# EAGLE design track_voltage_v1.2 (EAGLE 9.2.1)
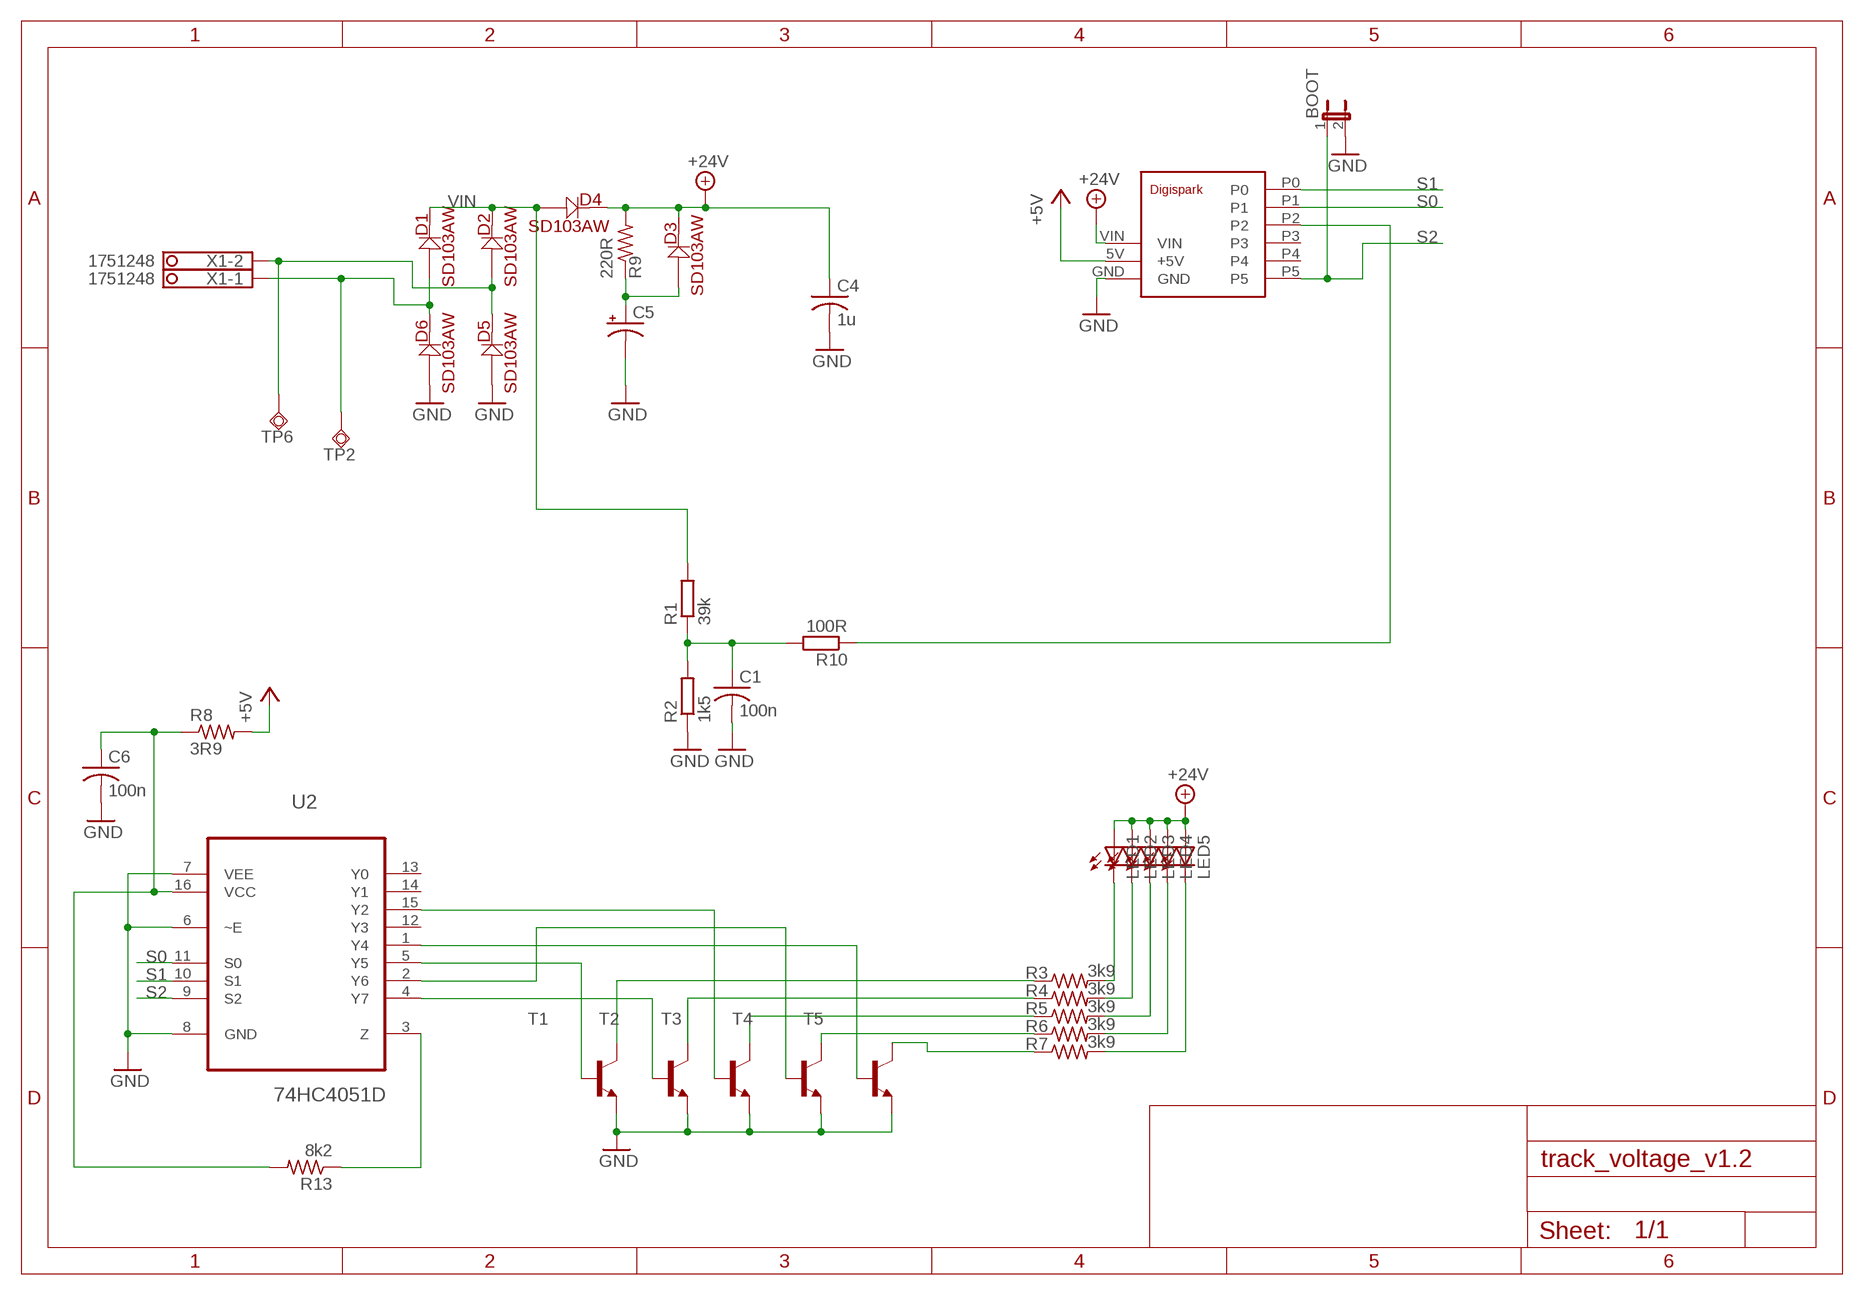
[diagram p0: schematic, sheet 1]

## Parts
BOOT  JP1E  [JP1]
C1  100n  C-USC0603  [C0603]
C4  1u  C-USC0603  [C0603]
C5  CPOL-USE3.5-10  [E3,5-10]
C6  100n  C-USC0603  [C0603]
D1  SD103AW  [SOD-123]
D2  SD103AW  [SOD-123]
D3  SD103AW  [SOD-123]
D4  SD103AW  [SOD-123]
D5  SD103AW  [SOD-123]
D6  SD103AW  [SOD-123]
LED1  LED3MM  [LED3MM]
LED2  LED3MM  [LED3MM]
LED3  LED3MM  [LED3MM]
LED4  LED3MM  [LED3MM]
LED5  LED3MM  [LED3MM]
R1  39k  R-EU_R0603  [R0603]
R2  1k5  R-EU_R0603  [R0603]
R3  3k9  R-US_R0805  [R0805]
R4  3k9  R-US_R0805  [R0805]
R5  3k9  R-US_R0805  [R0805]
R6  3k9  R-US_R0805  [R0805]
R7  3k9  R-US_R0805  [R0805]
R8  3R9  R-US_R1206  [R1206]
R9  220R  R-US_R0805  [R0805]
R10  100R  R-EU_R0603  [R0603]
R13  8k2  R-US_R0603  [R0603]
T1  BC817-16-NPN-SOT23-BEC  [SOT23-BEC]
T2  BC817-16-NPN-SOT23-BEC  [SOT23-BEC]
T3  BC817-16-NPN-SOT23-BEC  [SOT23-BEC]
T4  BC817-16-NPN-SOT23-BEC  [SOT23-BEC]
T5  BC817-16-NPN-SOT23-BEC  [SOT23-BEC]
TP2  TPSQTP20SQ  [TP20SQ]
TP6  TPSQTP20SQ  [TP20SQ]
U2  74HC4051D  [SOIC127P600X175-16N]
U$2  DIGISPARK  [DIGISPARK_78M05]
X1  1751248  [1751248]

## Nets
+5V: R8.2 U$2.5V(+5V)
+24V: C4.1 D3.- D4.- LED1.A LED2.A LED3.A LED4.A LED5.A R9.2 U$2.VIN
GND: BOOT.2 C1.2 C4.2 C5.- C6.2 D5.+ D6.+ R2.1 T1.E T2.E T3.E T4.E T5.E U2.6(~E) U2.7(VEE) U2.8(GND) U$2.GND
N$2: R10.1 U$2.P2
N$3: C6.1 R8.1 R13.2 U2.16(VCC)
N$4: T2.B U2.4(Y7)
N$6: T1.B U2.5(Y5)
N$8: LED1.K(C) R3.2
N$9: C5.+ D3.+ R9.1
N$11: R3.1 T1.C
N$12: R4.1 T2.C
N$13: R5.1 T3.C
N$14: R6.1 T4.C
N$15: R7.1 T5.C
N$16: LED2.K(C) R4.2
N$17: LED3.K(C) R5.2
N$18: LED4.K(C) R6.2
N$19: LED5.K(C) R7.2
N$21: D2.+ D5.- TP6.TP X1.2
N$22: C1.1 R1.1 R2.2 R10.2
N$25: T3.B U2.15(Y2)
N$26: D1.+ D6.- TP2.TP X1.1
N$27: T4.B U2.2(Y6)
N$28: T5.B U2.1(Y4)
N$29: R13.1 U2.3(Z)
S0: U2.11(S0) U$2.P1
S1: U2.10(S1) U$2.P0
S2: BOOT.1 U2.9(S2) U$2.P5
VIN: D1.- D2.- D4.+ R1.2
Unconnected: U2.12(Y3) U2.13(Y0) U2.14(Y1) U$2.P3 U$2.P4

## Library data of the parts
BOOT = jumper:JP1E: JUMPER
C1 C4 C6 = rcl:C-US: CAPACITOR, American symbol; SPICEPREFIX: C
C5 = rcl:CPOL-US: POLARIZED CAPACITOR, American symbol; SPICEPREFIX: C
D1-D6 = SD103AW:SD103AW
LED1-LED5 = led:LED: LED OSRAM: - CHIPLED LG R971, LG N971, LY N971, LG Q971, LY Q971, LO R971, LY R971 LH N974, LH R974 LS Q976, LO Q976, LY Q976 LO Q996 - Hyper CHIPLED LW Q18S LB Q993, LB Q99A, LB R99A - SideLED LS A670, LO A670, LY A670, LG A670, LP A670 LB A673, LV A673, LT A673, LW A673 LH A674 LY A675 LS A676, LA A676, LO A676, LY A676, LW A676 LS A679, LY A679, LG A679 - Hyper Micro SIDELED® LS Y876, LA Y876, LO Y876, LY Y876 LT Y87S - SmartLED LW L88C, LW L88S LB L89C, LB L89S, LG L890 LS L89K, LO L89K, LY L89K LS L896, LA L896, LO L896, LY L896 - TOPLED LS T670, LO T670, LY T670, LG T670, LP T670 LSG T670, LSP T670, LSY T670, LOP T670, LYG T670 LG T671, LOG T671, LSG T671 LB T673, LV T673, LT T673, LW T673 LH T674 LS T676, LA T676, LO T676, LY T676, LB T676, LH T676, LSB T676, LW T676 LB T67C, LV T67C, LT T67C, LS T67K, LO T67K, LY T67K, LW E67C LS E67B, LA E67B, LO E67B, LY E67B, LB E67C, LV E67C, LT E67C LW T67C LS T679, LY T679, LG T679 LS T770, LO T770, LY T770, LG T770, LP T770 LB T773, LV T773, LT T773, LW T773 LH T774 LS E675, LA E675, LY E675, LS T675 LS T776, LA T776, LO T776, LY T776, LB T776 LHGB T686 LT T68C, LB T68C - Hyper Mini TOPLED® LB M676 - Mini TOPLED Santana® LG M470 LS M47K, LO M47K, LY M47K Source: http://www.osram.convergy.de LUXEON: - LUMILED® LXK2-PW12-R00, LXK2-PW12-S00, LXK2-PW14-U00, LXK2-PW14-V00 LXK2-PM12-R00, LXK2-PM12-S00, LXK2-PM14-U00 LXK2-PE12-Q00, LXK2-PE12-R00, LXK2-PE12-S00, LXK2-PE14-T00, LXK2-PE14-U00 LXK2-PB12-K00, LXK2-PB12-L00, LXK2-PB12-M00, LXK2-PB14-N00, LXK2-PB14-P00, LXK2-PB14-Q00 LXK2-PR12-L00, LXK2-PR12-M00, LXK2-PR14-Q00, LXK2-PR14-R00 LXK2-PD12-Q00, LXK2-PD12-R00, LXK2-PD12-S00 LXK2-PH12-R00, LXK2-PH12-S00 LXK2-PL12-P00, LXK2-PL12-Q00, LXK2-PL12-R00 Source: www.luxeon.com KINGBRIGHT: KA-3528ASYC Source: www.kingbright.com
R1 R2 R10 = rcl:R-EU_: RESISTOR, European symbol; SPICEPREFIX: R
R3-R9 R13 = rcl:R-US_: RESISTOR, American symbol; SPICEPREFIX: R
T1-T5 = transistor:*-NPN-: NPN Transistror BF959 corrected 2008.03.06
TP2 TP6 = testpad:TPSQ: Test pad
U2 = 74HC4051D:74HC4051D: 8-channel analog multiplexer/demultiplexer; AVAILABILITY: Unavailable; DESCRIPTION: Single 8-Channel Analog Multiplexer/Demultiplexer, VCC=2 to 6V, PD=500mW, tpd/tpz=15ns_typ._; MF: Toshiba Semiconductor; MP: 74HC4051D; PACKAGE: SOIC-16 Toshiba; PRICE: None
U$2 = digispark:DIGISPARK
X1 = con-phoenix-350:1751248: MKDS 1/ 2-3,5 Printklemme Nennstrom: 10 A Bemessungsspannung: 160 V Raster: 3,5 mm Polzahl: 2 Montageart: Löten Anschlussart: Schraubanschluss Anschlussrichtung vom Leiter zur Platine: 0° Source: http://eshop.phoenixcontact.com .. 1751248.pdf; OC_FARNELL: unknown; OC_NEWARK: unknown

## Board
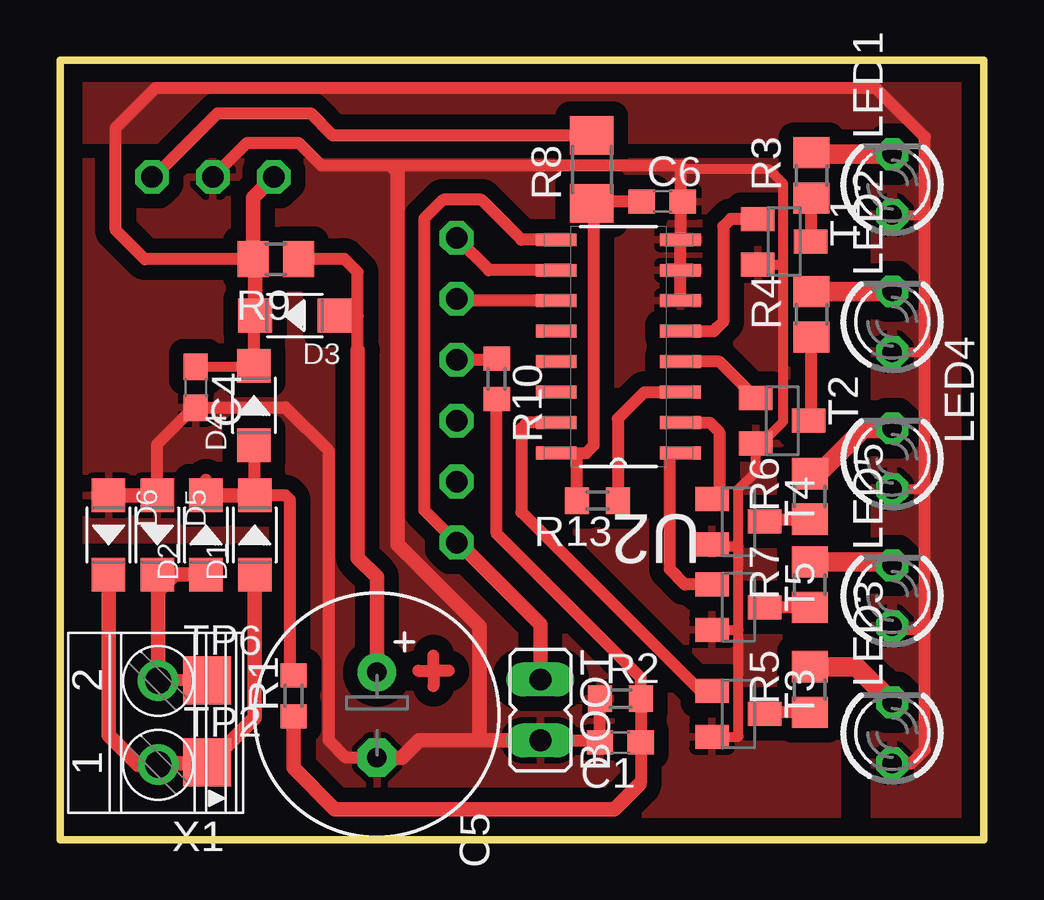
[diagram p1: board, top side]
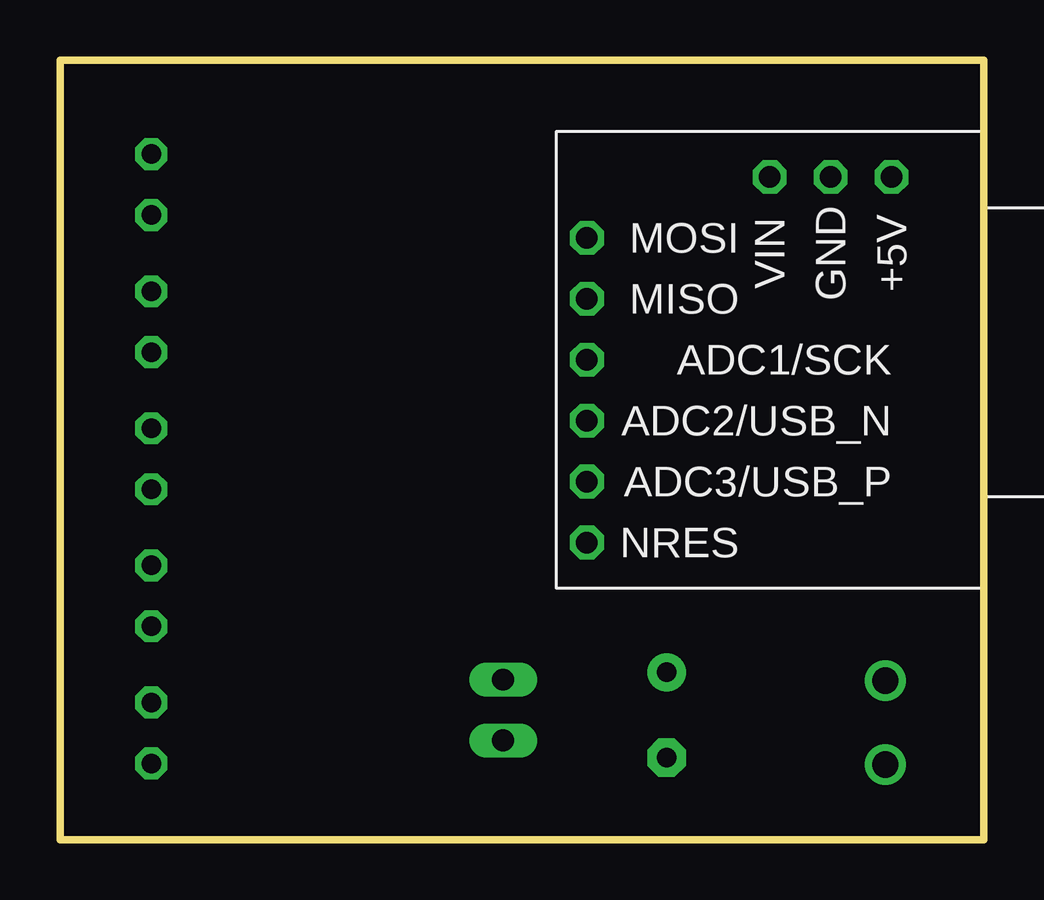
[diagram p2: board, bottom side, seen from below]

Size 38.5 x 32.5 mm. Coordinates in mm from the lower left corner, seen from the top.
Outline: 0,0 38.5,0 38.5,32.5 0,32.5 0,0
Copper layers (1*16): Top 0.035mm / dielectric 1.5mm / Bottom 0.035mm
Design rules "default *": minimum track width 6mil, minimum drill 0.35mm, track to track 6mil, track to pad 6mil, pad to pad 6mil, via to via 6mil, smd to smd 6mil, copper to edge 30mil, drill to drill 6mil, minimum pad ring 10mil, minimum via ring 8mil, stop-mask expansion 4mil, vias tented up to drill 0mil, thermal gap 10mil

### Footprints (pad centres in the part's own frame; a part is rotated, then mirrored left to right if it is on the bottom)
JP1 = drill 0.914 long: 1 0,-1.27; 2 0,1.27
C0603 = smd 1.1 x 1: 1 -0.85,0; 2 0.85,0
E3,5-10 = drill 0.813 pad 1.6: + -1.778,0 | drill 0.813 pad 1.6 octagon: - 1.778,0
SOD-123 = smd 1.397 x 1.397: + -1.651,0; - 1.651,0
LED3MM = drill 0.813 octagon: A -1.27,0; K 1.27,0
R0603 = smd 1 x 1.1: 1 -0.85,0; 2 0.85,0
R0805 = smd 1.3 x 1.5: 1 -0.95,0; 2 0.95,0
R1206 = smd 1.6 x 1.803: 1 -1.422,0; 2 1.422,0
SOT23-BEC = smd 1 x 1.4: B -0.95,-1.1; C 0,1.1; E 0.95,-1.1
TP20SQ = smd 2 x 2: TP 0,0
SOIC127P600X175-16N = smd 1.702 x 0.533: 1 -2.591,4.445; 2 -2.591,3.175; 3 -2.591,1.905; 4 -2.591,0.635; 5 -2.591,-0.635; 6 -2.591,-1.905; 7 -2.591,-3.175; 8 -2.591,-4.445; 9 2.591,-4.445; 10 2.591,-3.175; 11 2.591,-1.905; 12 2.591,-0.635; 13 2.591,0.635; 14 2.591,1.905; 15 2.591,3.175; 16 2.591,4.445
DIGISPARK_78M05 = drill 0.9 octagon: 5V 2.54,0; GND 5.08,0; P0 15.24,2.54; P1 15.24,5.08; P2 15.24,7.62; P3 15.24,10.16; P4 15.24,12.7; P5 15.24,15.24; VIN 7.62,0
1751248 = drill 1.1 pad 1.7: 1 -1.75,-0.1; 2 1.75,-0.1

### Placement (x,y rotation side)
BOOT  20.03,5.4 180 top
C1  23.36,4.05 180 top
C4  5.67,18.85 270 top
C5  13.22,5.19 270 top
C6  25.11,26.59 0 top
D1  8.12,12.7 90 top
D2  6.09,12.7 90 top
D3  9.79,21.84 180 top
D4  8.09,18.1 90 top
D5  4.06,12.7 270 top
D6  2.02,12.7 270 top
LED1  34.69,27.3 90 top
LED2  34.69,21.59 90 top
LED3  34.69,4.45 90 top
LED4  34.69,15.88 90 top
LED5  34.69,10.16 90 top
R1  9.74,5.99 90 top
R2  23.36,5.87 0 top
R3  31.33,27.69 90 top
R4  31.33,21.89 90 top
R5  31.25,6.25 90 top
R6  31.25,14.3 90 top
R7  31.25,10.62 90 top
R8  22.17,27.94 90 top
R9  9,24.19 180 top
R10  18.2,19.21 270 top
R13  22.41,14.13 180 top
T1  30.19,24.92 270 top
T2  30.11,17.46 270 top
T3  28.28,5.24 270 top
T4  28.28,13.26 270 top
T5  28.28,9.68 270 top
TP2  6.14,3.22 0 top
TP6  6.14,6.64 0 top
U2  23.28,20.56 180 top
U$2  1.29,27.62 180 bottom
X1  3.99,4.87 90 top

### Tracks (layer width: path | path; a pad name or v marks a point on that pad's centre or on a via)
+5V
  Top 0.508: U$2.5V 3.91,27.62 6.57,30.28 10.46,30.28 11.37,29.36 R8.2
+24V
  Top 0.406: D4.- 8.04,19.7 C4.1 | LED1.A 36.06,26.04 | LED2.A 36.06,20.32 | LED4.A 36.06,14.61 | LED5.A 34.85,8.73 36.06,8.73
  Top 0.508: LED3.A 35.49,3.17 36.06,3.75 36.06,8.73 36.06,14.61 36.06,20.32 36.06,26.04 36.06,29.29 34.02,31.33 3.97,31.33 2.33,29.69 2.33,25.4 3.53,24.19 R9.2 | D4.- 8.09,21.8 D3.-
  Top 0.61: 8.12,19.78 D4.- | R9.2 7.98,24.13 | D3.- 8.14,24.1 R9.2 | R9.2 8.05,26.75 U$2.VIN
  pour Top (isolate 0.61): 41.77,32.7 -5.37,32.7 -5.37,29.21 34,29.21 34,-1.91 41.77,-1.91
GND
  Top 0.305: T3.E
  Top 0.406: T3.E 28.28,4.29 28.28,8.73 | 28.28,8.73 28.28,12.22 | 28.28,12.22 28.28,14.61 29.01,15.33 T2.E 29.24,16.51 30.15,17.43 30.15,24.13 | T4.E 27.26,12.22 28.28,12.22 | T5.E 28.28,8.73 | 25.87,27.94 29.55,27.94 30.15,27.34 30.15,24.13 | T1.E 30,23.97 30.15,24.13
  Top 0.508: U2.6 U2.7 U2.8 25.87,26.59 | 25.87,26.59 25.87,27.94 25.87,28.1 13.76,28.1 | 13.76,28.1 10.9,28.1 9.95,29.05 7.8,29.05 U$2.GND | BOOT.2 22.43,4.13 C1.2 R2.1 | C6.2 25.87,26.59 | D5.+ 4.06,16.49 5.58,18.02 9.39,18.02 11.22,16.19 11.22,4.13 11.93,3.41 C5.- | 13.76,28.1 14.07,27.78
  Top 0.61: D6.+ D5.+ | BOOT.2 14.96,4.13 14.25,3.41 C5.- | 17.49,4.13 17.49,8.89 14.07,12.3 14.07,27.78
  pour Top (isolate 0.61): -1.25,28.26 32.41,28.26 32.41,-3.02 -1.25,-3.02
N$2
  Top 0.508: U$2.P2 18.14,20 R10.1
N$3
  Top 0.508: U2.16 21.61,16.11 | 21.61,16.11 21.93,16.11 22.25,16.43 22.25,26.44 R8.1 22.24,26.59 C6.1 | R13.2 21.56,16.06 21.61,16.11
N$4
  Top 0.508: T2.B 27.5,19.92 U2.4
N$6
  Top 0.508: T1.B 27.96,25.87 27.65,25.56 27.65,21.59 27.41,21.35 27.33,21.27 27.25,21.19 U2.5
N$8
  Top 0.508: 31.39,28.57 R3.2
  Top 0.61: 34.63,28.64 LED1.K
  Top 0.813: LED1.K 31.39,28.57
N$9
  Top 0.508: 12.41,20.4 12.41,21.83 | 12.41,21.83 12.41,23.65 11.85,24.21 11.84,24.19 R9.1 | D3.+ 11.45,21.83 12.41,21.83
  Top 0.61: C5.+ 13.22,10.94 12.41,11.75 12.41,20.4
N$11
  Top 0.508: T1.C 31.33,24.97 R3.1
N$12
  Top 0.508: T2.C 31.33,17.59 R4.1
N$13
  Top 0.508: R5.1 29.45,5.3 T3.C
N$14
  Top 0.508: T4.C 29.48,13.35 R6.1
N$15
  Top 0.508: R7.1 T5.C
N$16
  Top 0.508: LED2.K 34.68,22.84
  Top 0.813: 34.68,22.84 R4.2
N$17
  Top 0.813: R5.2 33.2,7.2 LED3.K
N$18
  Top 0.508: 31.62,15.25 R6.2
  Top 0.813: LED4.K 33.52,17.14 31.62,15.25
N$19
  Top 0.508: 34.55,11.57 LED5.K
  Top 0.813: R7.2 34.55,11.57
N$21
  Top 0.508: TP6.TP 4.1,6.64 X1.2
  Top 0.61: D5.- 4.79,11.05 | 4.79,11.05 D2.+ | X1.2 4.09,10.36 4.79,11.05
N$22
  Top 0.508: 24.15,2.3 24.21,2.36 C1.1 R2.2 24.21,6.75 18.2,12.76 R10.2
  Top 0.61: R1.1 9.74,2.98 11.45,1.27 23.12,1.27 24.15,2.3
N$24
  Top 0.508: 14.93,7.03 15.56,7.03 | 16.2,7.03 15.56,7.03 | 15.56,7.03 15.56,7.67 | 15.56,7.03 15.56,6.4
N$25
  Top 0.508: U2.15 19.47,17.38 19.23,17.14 19.23,13.65 26.7,6.19 T3.B
N$26
  Top 0.508: TP2.TP 4.19,3.22 X1.1
  Top 0.61: D6.- 2.02,4.35 3.25,3.12 X1.1 4.14,3.17 6.21,3.17 8.12,5.08 D1.+
N$27
  Top 0.508: U2.2 27.09,17.38 27.49,16.99 27.49,14.51 T4.B
N$28
  Top 0.508: T5.B 26.06,10.63 25.42,11.27 25.42,15.98 25.55,16.11 U2.1
N$29
  Top 0.508: U2.3 24.37,18.65 23.26,17.54 R13.1
S0
  Top 0.508: U2.11 16.61,22.46 U$2.P1
S1
  Top 0.508: U2.10 17.88,23.73 U$2.P0
S2
  Top 0.508: U2.9 19.23,25 17.57,26.67 15.98,26.67 15.18,25.88 15.18,13.73 U$2.P5
  Top 0.61: U$2.P5 16.61,12.38 20.03,8.97 BOOT.1
VIN
  Top 0.508: 6.09,15.01 D2.- | D4.+ 8.09,14.38 D1.- 9.41,14.35 9.58,14.18 9.58,7 R1.2
  Top 0.61: D2.- D1.-